# Altium schematic sheet Mako DSP Memory R2.1.SchDoc
size A
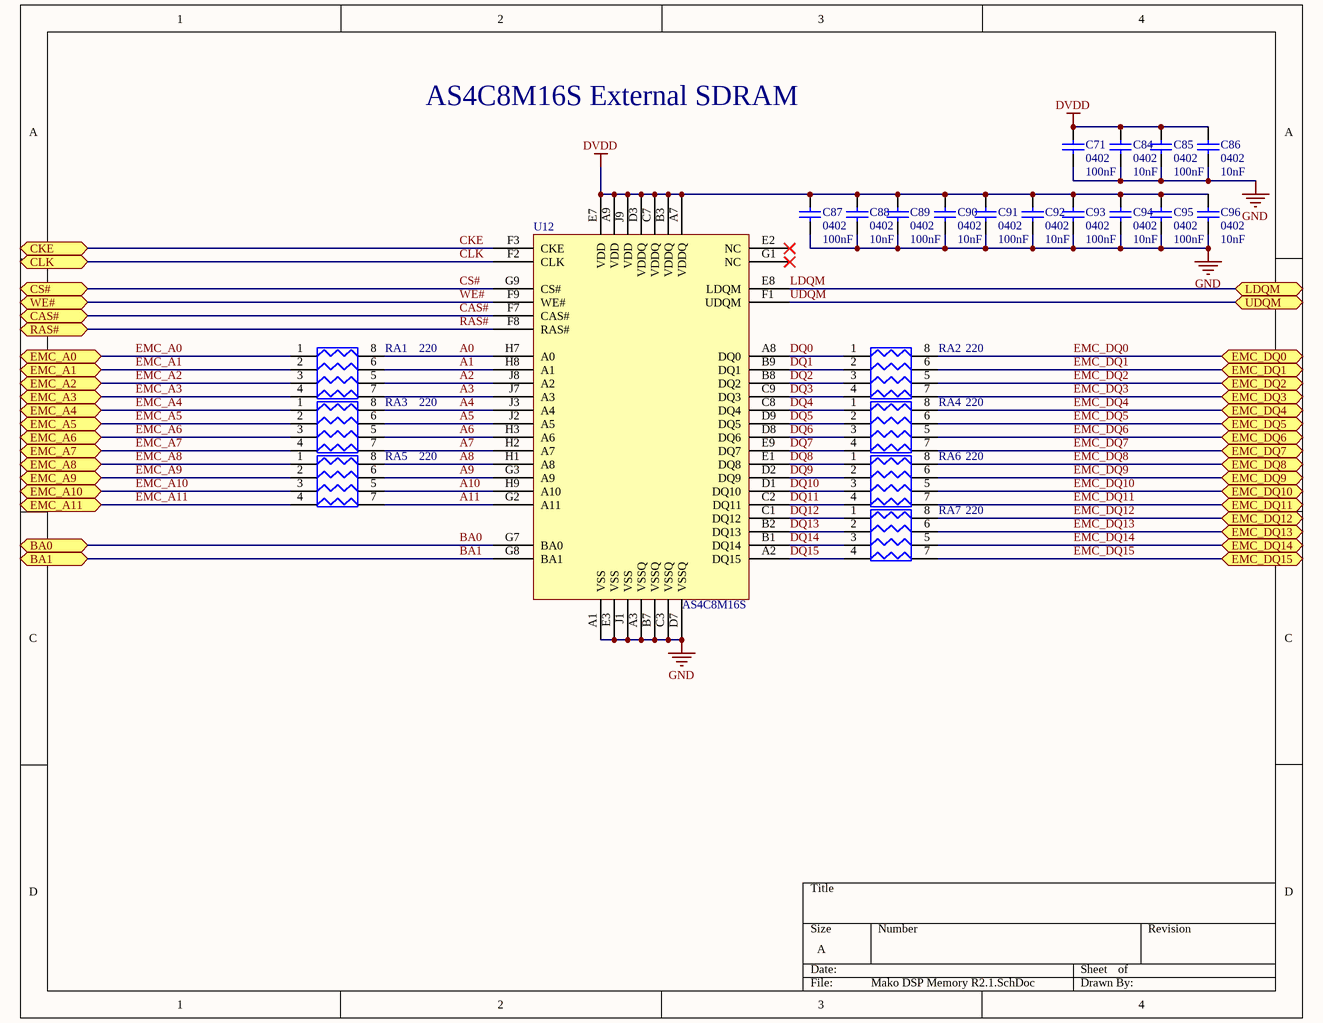
[diagram p0: Mako DSP Memory R2.1.SchDoc]

## Parts
C71  0402  value 100nF  [0402]
C84  0402  value 10nF  [0402]
C85  0402  value 100nF  [0402]
C86  0402  value 10nF  [0402]
C87  0402  value 100nF  [0402]
C88  0402  value 10nF  [0402]
C89  0402  value 100nF  [0402]
C90  0402  value 10nF  [0402]
C91  0402  value 100nF  [0402]
C92  0402  value 10nF  [0402]
C93  0402  value 100nF  [0402]
C94  0402  value 10nF  [0402]
C95  0402  value 100nF  [0402]
C96  0402  value 10nF  [0402]
RA1  value 220  [742C083]  (hidden comment: RESISTOR ARRAY)
RA2  value 220  [742C083]  (hidden comment: RESISTOR ARRAY)
RA3  value 220  [742C083]  (hidden comment: RESISTOR ARRAY)
RA4  value 220  [742C083]  (hidden comment: RESISTOR ARRAY)
RA5  value 220  [742C083]  (hidden comment: RESISTOR ARRAY)
RA6  value 220  [742C083]  (hidden comment: RESISTOR ARRAY)
RA7  value 220  [742C083]  (hidden comment: RESISTOR ARRAY)
U12  AS4C8M16S  [AS4C8M16S]

## Ports
BA0, BA1, CAS#, CKE, CLK, CS#, EMC_A0, EMC_A1, EMC_A2, EMC_A3, EMC_A4, EMC_A5, EMC_A6, EMC_A7, EMC_A8, EMC_A9, EMC_A10, EMC_A11, EMC_DQ0, EMC_DQ1, EMC_DQ2, EMC_DQ3, EMC_DQ4, EMC_DQ5, EMC_DQ6, EMC_DQ7, EMC_DQ8, EMC_DQ9, EMC_DQ10, EMC_DQ11, EMC_DQ12, EMC_DQ13, EMC_DQ14, EMC_DQ15, LDQM, RAS#, UDQM, WE#

## Nets
DVDD: C71.2 C84.2 C85.2 C86.2 C87.2 C88.2 C89.2 C90.2 C91.2 C92.2 C93.2 C94.2 C95.2 C96.2 U12.A7(VDDQ) U12.A9(VDD) U12.B3(VDDQ) U12.C7(VDDQ) U12.D3(VDDQ) U12.E7(VDD) U12.J9(VDD)
GND: C71.1 C84.1 C85.1 C86.1 C87.1 C88.1 C89.1 C90.1 C91.1 C92.1 C93.1 C94.1 C95.1 C96.1 U12.A1(VSS) U12.A3(VSSQ) U12.B7(VSSQ) U12.C3(VSSQ) U12.D7(VSSQ) U12.E3(VSS) U12.J1(VSS)
A0: RA1.8 U12.H7(A0)
A1: RA1.6 U12.H8(A1)
A2: RA1.5 U12.J8(A2)
A3: RA1.7 U12.J7(A3)
A4: RA3.8 U12.J3(A4)
A5: RA3.6 U12.J2(A5)
A6: RA3.5 U12.H3(A6)
A7: RA3.7 U12.H2(A7)
A8: RA5.8 U12.H1(A8)
A9: RA5.6 U12.G3(A9)
A10: RA5.5 U12.H9(A10)
A11: RA5.7 U12.G2(A11)
BA0: U12.G7(BA0) ; port BA0
BA1: U12.G8(BA1) ; port BA1
CAS#: U12.F7(CAS#) ; port CAS#
CKE: U12.F3(CKE) ; port CKE
CLK: U12.F2(CLK) ; port CLK
CS#: U12.G9(CS#) ; port CS#
DQ0: RA2.1 U12.A8(DQ0)
DQ1: RA2.2 U12.B9(DQ1)
DQ2: RA2.3 U12.B8(DQ2)
DQ3: RA2.4 U12.C9(DQ3)
DQ4: RA4.1 U12.C8(DQ4)
DQ5: RA4.2 U12.D9(DQ5)
DQ6: RA4.3 U12.D8(DQ6)
DQ7: RA4.4 U12.E9(DQ7)
DQ8: RA6.1 U12.E1(DQ8)
DQ9: RA6.2 U12.D2(DQ9)
DQ10: RA6.3 U12.D1(DQ10)
DQ11: RA6.4 U12.C2(DQ11)
DQ12: RA7.1 U12.C1(DQ12)
DQ13: RA7.2 U12.B2(DQ13)
DQ14: RA7.3 U12.B1(DQ14)
DQ15: RA7.4 U12.A2(DQ15)
EMC_A0: RA1.1 ; port EMC_A0
EMC_A1: RA1.2 ; port EMC_A1
EMC_A2: RA1.3 ; port EMC_A2
EMC_A3: RA1.4 ; port EMC_A3
EMC_A4: RA3.1 ; port EMC_A4
EMC_A5: RA3.2 ; port EMC_A5
EMC_A6: RA3.3 ; port EMC_A6
EMC_A7: RA3.4 ; port EMC_A7
EMC_A8: RA5.1 ; port EMC_A8
EMC_A9: RA5.2 ; port EMC_A9
EMC_A10: RA5.3 ; port EMC_A10
EMC_A11: RA5.4 ; port EMC_A11
EMC_DQ0: RA2.8 ; port EMC_DQ0
EMC_DQ1: RA2.6 ; port EMC_DQ1
EMC_DQ2: RA2.5 ; port EMC_DQ2
EMC_DQ3: RA2.7 ; port EMC_DQ3
EMC_DQ4: RA4.8 ; port EMC_DQ4
EMC_DQ5: RA4.6 ; port EMC_DQ5
EMC_DQ6: RA4.5 ; port EMC_DQ6
EMC_DQ7: RA4.7 ; port EMC_DQ7
EMC_DQ8: RA6.8 ; port EMC_DQ8
EMC_DQ9: RA6.6 ; port EMC_DQ9
EMC_DQ10: RA6.5 ; port EMC_DQ10
EMC_DQ11: RA6.7 ; port EMC_DQ11
EMC_DQ12: RA7.8 ; port EMC_DQ12
EMC_DQ13: RA7.6 ; port EMC_DQ13
EMC_DQ14: RA7.5 ; port EMC_DQ14
EMC_DQ15: RA7.7 ; port EMC_DQ15
LDQM: U12.E8(LDQM) ; port LDQM
RAS#: U12.F8(RAS#) ; port RAS#
UDQM: U12.F1(UDQM) ; port UDQM
WE#: U12.F9(WE#) ; port WE#

Not connected (* = marked no-connect by the designer): U12 E2(NC)* G1(NC)*

## Notes on the sheet
- AS4C8M16S External SDRAM

## Library data of the parts
C71 C84-C96 = Cap Semi: Capacitor (Semiconductor SIM Model); Published: 8-Jun-2000; LatestRevisionDate: 29-May-2009; LatestRevisionNote: IPC-7351 Footprint Added.; PackageReference: C1206; Publisher: Altium Limited; PackageDescription: Chip Capacitor